# EAGLE design powerboost (EAGLE 7.6.0)
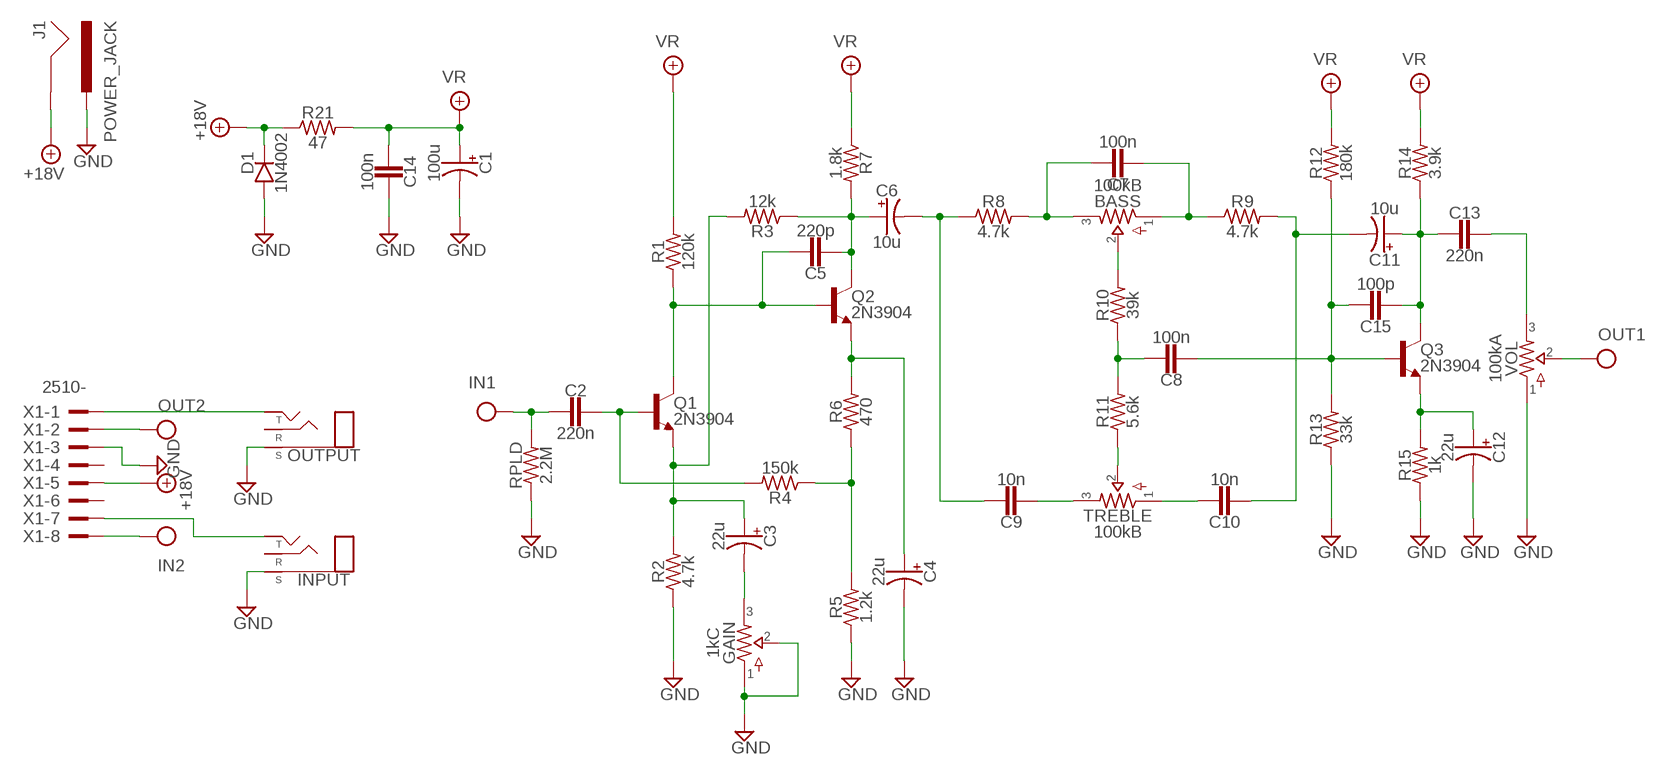
[diagram p0: schematic, sheet 1]

## Parts
BASS  100kB  POTS16MM  [16MM]
C1  100u  0631  [063_025]
C2  220n  CER/FILMBOX.1  [BOX_SMALL]
C3  22u  0500  [050_020]
C4  22u  0500  [050_020]
C5  220p  CER/FILM2  [050X030_025_2]
C6  10u  0501  [050_020_1]
C7  100n  CER/FILMBOX.1  [BOX_SMALL]
C8  100n  CER/FILMBOX.1  [BOX_SMALL]
C9  10n  CER/FILMBOX.1  [BOX_SMALL]
C10  10n  CER/FILMBOX.1  [BOX_SMALL]
C11  10u  0501  [050_020_1]
C12  22u  0500  [050_020]
C13  220n  CER/FILMBOX.1  [BOX_SMALL]
C14  100n  CER/FILM2  [050X030_025_2]
C15  100p  CER/FILM2  [050X030_025_2]
D1  1N4002  DO41.2  [DO41-2]
GAIN  1kC  POTS16MM  [16MM]
INPUT  STEREONMJ  [NMJ6HCD2]
J1  POWER_JACK  [POWER_JACK_PTH]
OUTPUT  STEREONMJ  [NMJ6HCD2]
Q1  2N3904  [TO92-]
Q2  2N3904  [TO92-]
Q3  2N3904  [TO92-]
R1  120k  R_.3B  [R0207/3]
R2  4.7k  R_.3B  [R0207/3]
R3  12k  R_.3B  [R0207/3]
R4  150k  R_.3B  [R0207/3]
R5  1.2k  R_.3B  [R0207/3]
R6  470  R_.3B  [R0207/3]
R7  1.8k  R_.3B  [R0207/3]
R8  4.7k  R_.3B  [R0207/3]
R9  4.7k  R_.3B  [R0207/3]
R10  39k  R_.3B  [R0207/3]
R11  5.6k  R_.3B  [R0207/3]
R12  180k  R_.3B  [R0207/3]
R13  33k  R_.3B  [R0207/3]
R14  3.9k  R_.3B  [R0207/3]
R15  1k  R_.3B  [R0207/3]
R21  47  R_.3B  [R0207/3]
RPLD  2.2M  R_.3B  [R0207/3]
TREBLE  100kB  POTS16MM  [16MM]
VOL  100kA  POTS16MM  [16MM]
X1  2510-  [PAK100/2500-10]

## Nets
+18V: D1.C J1.GND R21.1 X1.5
GND: C1.- C4.- C12.- C14.1 D1.A GAIN.1 GAIN.2 INPUT.S J1.PWR OUTPUT.S R2.1 R5.1 R13.1 R15.1 RPLD.1 VOL.1 X1.3
IN: C2.2 RPLD.2 X1.8
N$1: INPUT.T X1.7
N$4: OUTPUT.T X1.1
N$6: C5.1 Q1.1(C) Q2.2(B) R1.1
N$7: C2.1 Q1.2(B) R4.2
N$8: C3.+ Q1.3(E) R2.2 R3.2
N$9: C3.- GAIN.3
N$10: C5.2 C6.+ Q2.1(C) R3.1 R7.2
N$11: C6.- C9.1 R8.1
N$12: R4.1 R5.2 R6.1
N$14: BASS.3 C7.1 R8.2
N$15: BASS.1 C7.2 R9.1
N$16: BASS.2 R10.2
N$17: R11.1 TREBLE.2
N$18: C8.1 R10.1 R11.2
N$19: C9.2 TREBLE.3
N$20: C10.1 TREBLE.1
N$21: C10.2 C11.- R9.2
N$22: C8.2 C15.1 Q3.2(B) R12.1 R13.2
N$23: C11.+ C13.2 C15.2 Q3.1(C) R14.1
N$24: C12.+ Q3.3(E) R15.2
N$25: C13.1 VOL.3
N$26: C4.+ Q2.3(E) R6.2
OUT: VOL.2 X1.2
VR: C1.+ C14.2 R1.2 R7.1 R12.2 R14.2 R21.2
Unconnected: INPUT.R OUTPUT.R X1.4 X1.6

## Library data of the parts
BASS GAIN TREBLE VOL = pedals-potentiometers:POTS
C1 = pedals-capacitors-elec:063: 33 - 220uF Xicon values at Mouser.com 10V: 220uF; 16V: 100uF; 25V: 100uF; 50V: 33uF
C2 C5 C7-C10 C13-C15 = pedals-capacitors-film:CER/FILM: 47 - 120pF Xicon Ceramic Disc 2.5mm lead spacing
C3 C4 C6 C11 C12 = pedals-capacitors-elec:050
D1 = pedals-diodes:DO41: DO-41 Package Diodes: 1N4001 - 1N40019 Zener Diodes: 1N4728 - 1N4764
INPUT OUTPUT = pedals-jacks:STEREO
J1 = pedals-jacks:POWER_JACK: Power Jack Connector This is the standard 5.5mm barrel jack for power. The PTH is the most common, proven, reliable, footprint. The Slot footprint only works if the mill layer is transmitted to the PCB fab house so be warned. Here are the connectors we sell at SparkFun: DC Barrel Power Jack/Connector <https://www.sparkfun.com/products/119> (PRT-00119) DC Barrel Power Jack/Connector (SMD) <https://www.sparkfun.com/products/12748> (PRT-12748) DC Barrel Jack Adapter - Breadboard Compatible <https://www.sparkfun.com/products/10811> (PRT-10811) It is used on this SparkFun product (and many, many others): SparkFun RedBoard - Programmed with Arduino <https://www.sparkfun.com/products/12757> (DEV-12757) Also, if you need a mating power supply or connector, please check these out: Wall Adapter Power Supply - 9VDC 650mA <https://www.sparkfun.com/products/298> (TOL-00298) DC Barrel Jack Adapter - Male <https://www.sparkfun.com/products/10287> (PRT-10287); PROD_ID: CONN-08197
Q1-Q3 = pedals-transistors:2N3904: NPN Transistor
R1-R15 R21 RPLD = pedals-resistors:R_
X1 = pedals-headers:2510-: 3M (TM) Pak 100 4-Wall Header Source: 3M; MF: 3M; MPN: 2510-6002UB; OC_FARNELL: 9838244; OC_NEWARK: 46F4725

## Board
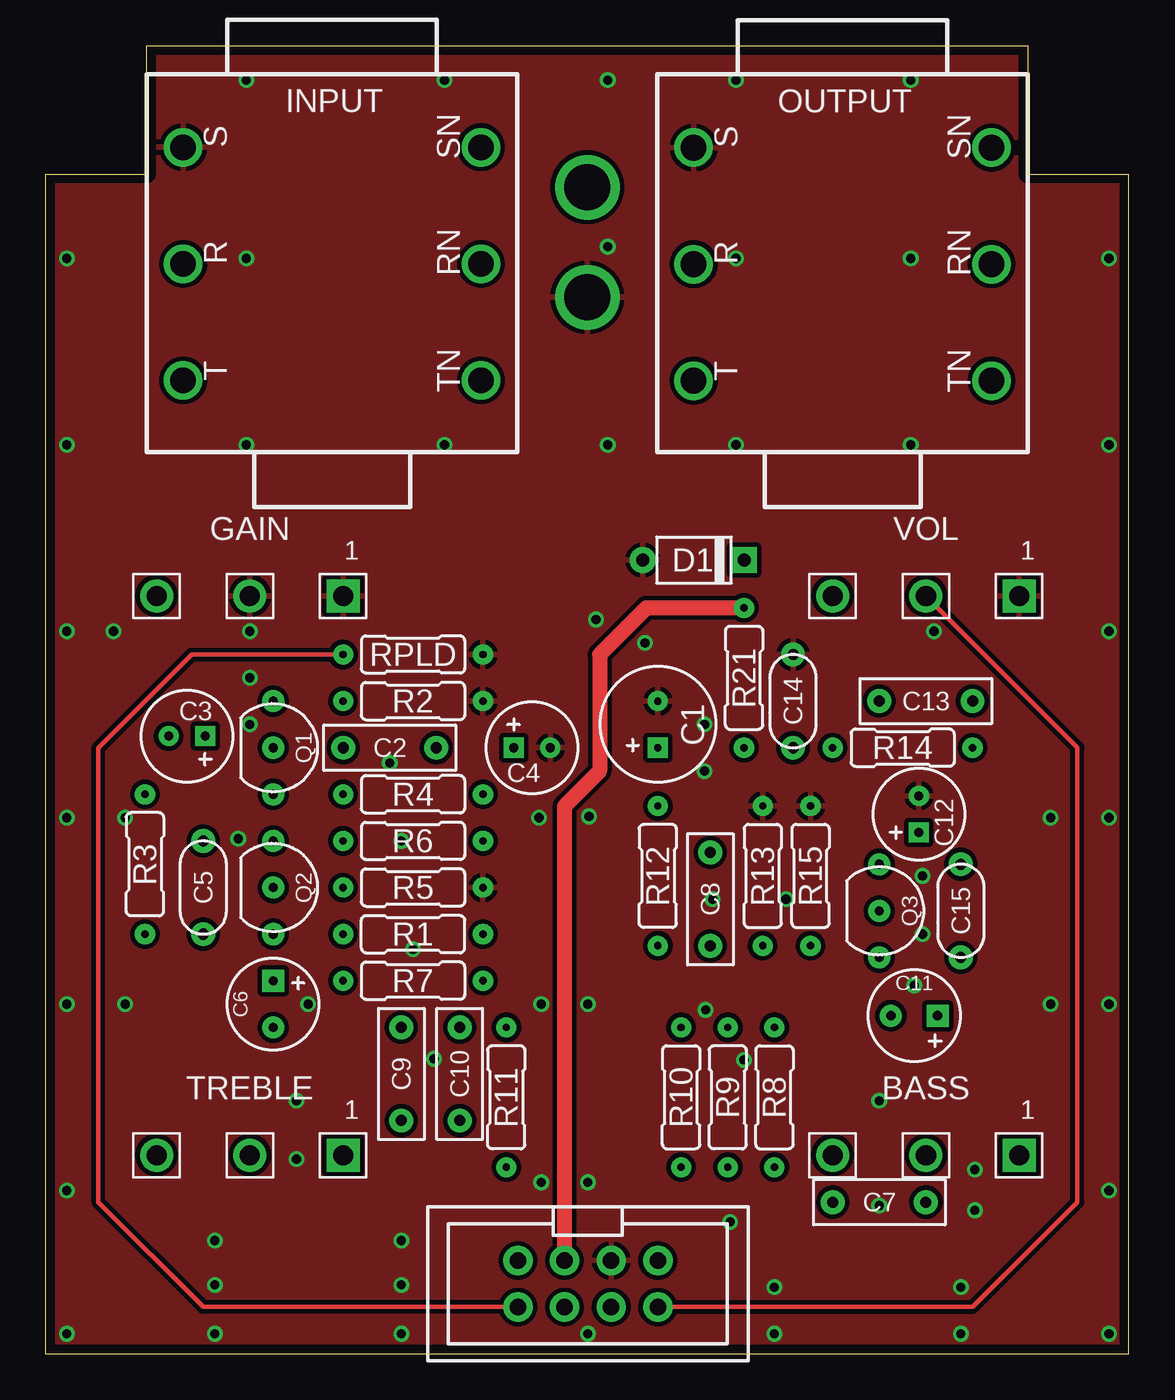
[diagram p1: board, top side]
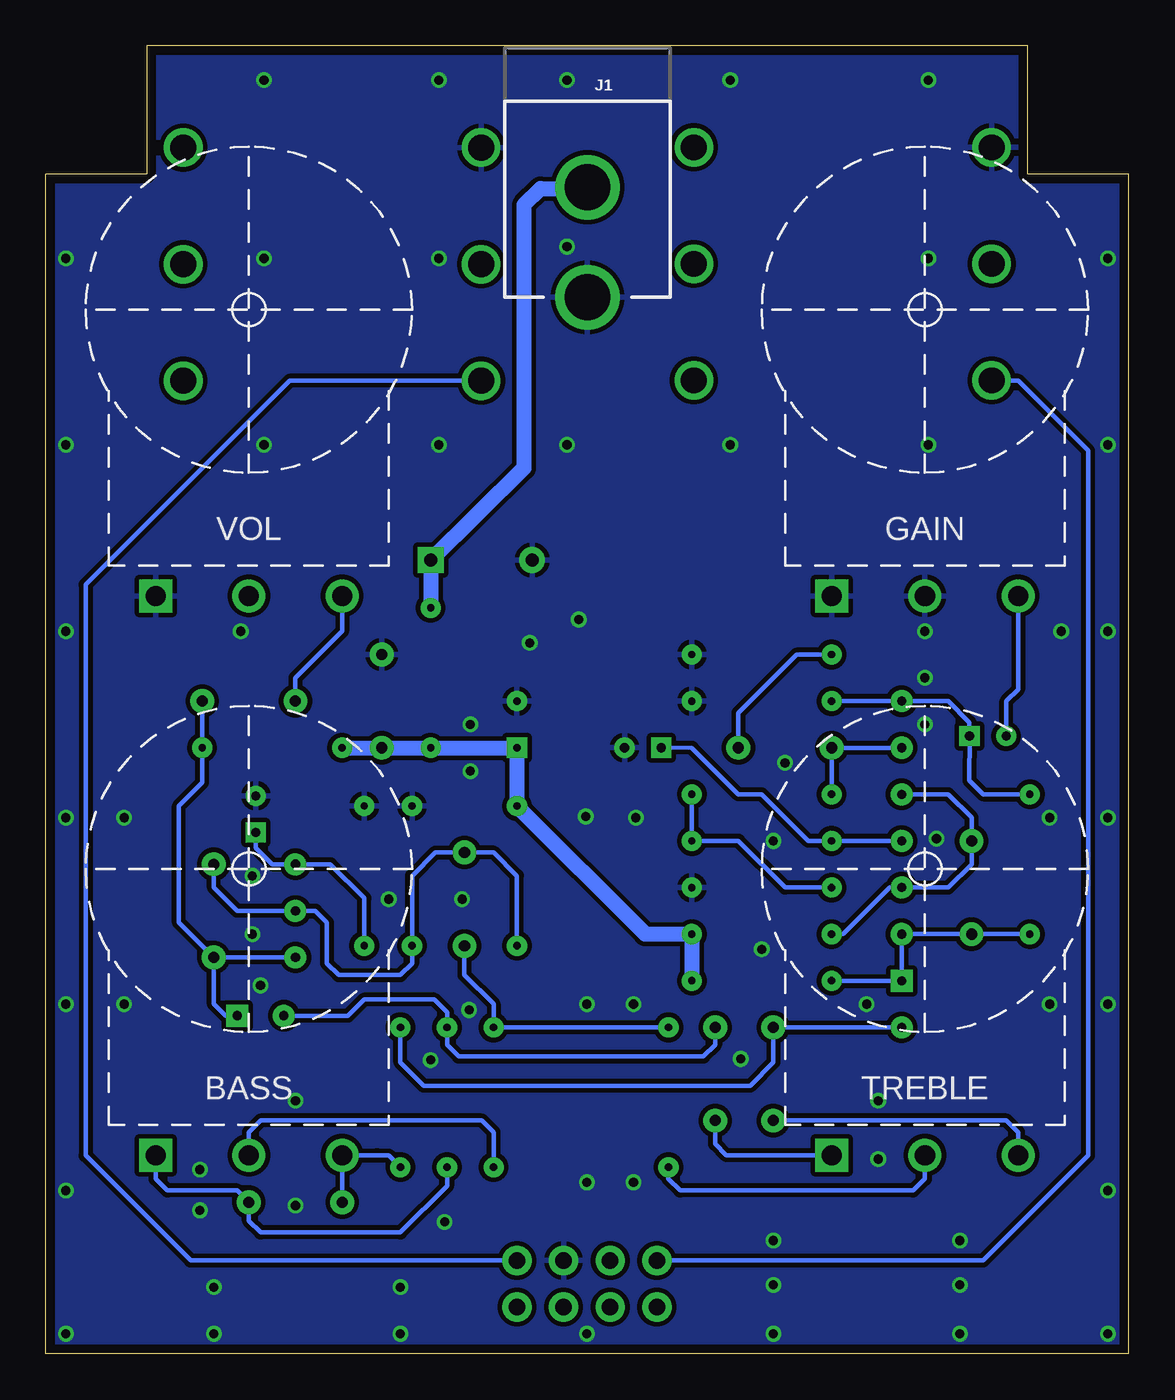
[diagram p2: board, bottom side, seen from below]

Size 59 x 71.27 mm. Coordinates in mm from the lower left corner, seen from the top.
Copper layers (1*16): Top 0.035mm / dielectric 1.6mm / Bottom 0.035mm
Design rules "Elecrow_2-layer_PCB_eagle_rule": minimum track width 6mil, minimum drill 12mil, track to track 6mil, track to pad 6mil, pad to pad 6mil, via to via 8mil, smd to smd 0mil, copper to edge 20mil, drill to drill 10mil, minimum pad ring 6mil, minimum via ring 6mil, stop-mask expansion 0mil, vias tented up to drill 100mil, thermal gap 10mil

### Footprints (pad centres in the part's own frame; a part is rotated, then mirrored left to right if it is on the bottom)
16MM = drill 1.1 pad 1.8 square: 1 5.08,-1 | drill 1.1 pad 1.8: 2 0,-1; 3 -5.08,-1
063_025 = drill 0.4 pad 1.1 square: + -1.27,0 | drill 0.4 pad 1.1: - 1.27,0
BOX_SMALL = drill 0.6 pad 1.3: 1 -2.54,0; 2 2.54,0
050_020 = drill 0.5 pad 1.1 square: + -0.998,0.001 | drill 0.5 pad 1.1: - 0.998,0.001
050X030_025_2 = drill 0.6 pad 1.3: 1 -2.54,0; 2 2.54,0
050_020_1 = drill 0.5 pad 1.2 square: + -1.27,0 | drill 0.5 pad 1.2: - 1.27,0
DO41-2 = drill 0.7 pad 1.4: A 2.794,0 | drill 0.7 pad 1.4 square: C -2.731,0
NMJ6HCD2 = drill 1.4: R 0,8.115; RN 0,-8.115; S 6.35,8.115; SN 6.35,-8.115; T -6.35,8.115; TN -6.35,-8.115
POWER_JACK_PTH = drill 2.5: GND 0,7.7; PWR 0,13.7
TO92- = drill 0.5 pad 1.2: 1 2.54,0; 2 0,0; 3 -2.54,0
R0207/3 = drill 0.4 pad 1.1: 1 -3.81,0; 2 3.81,0
PAK100/2500-10 = drill 0.9 pad 1.6: 1 -3.81,-1.27; 2 -3.81,1.27; 3 -1.27,-1.27; 4 -1.27,1.27; 5 1.27,-1.27; 6 1.27,1.27; 7 3.81,-1.27; 8 3.81,1.27

### Placement (x,y rotation side)
BASS  47.94,11.81 0 top
C1  33.34,34.29 90 top
C2  18.73,33.02 0 top
C3  7.68,33.66 180 top
C4  26.48,33.02 0 top
C5  8.57,25.4 270 top
C6  12.38,19.05 270 top
C7  45.4,8.26 0 top
C8  36.2,24.77 90 top
C9  19.37,15.24 270 top
C10  22.54,15.24 90 top
C11  47.31,18.41 180 top
C12  47.56,29.4 90 top
C13  47.94,35.56 0 top
C14  40.7,35.56 270 top
C15  49.85,24.13 270 top
D1  35.31,43.24 180 top
GAIN  11.11,42.29 0 top
INPUT  15.59,59.39 90 top
J1  29.5,71.27 180 bottom
OUTPUT  43.4,59.37 90 top
Q1  12.38,33.02 270 top
Q2  12.38,25.4 270 top
Q3  45.4,24.13 270 top
R1  20,22.86 0 top
R2  20,35.56 180 top
R3  5.4,26.67 90 top
R4  20,30.48 180 top
R5  20,25.4 180 top
R6  20,27.94 180 top
R7  20,20.32 180 top
R8  39.69,13.97 270 top
R9  37.15,13.97 90 top
R10  34.61,13.97 270 top
R11  25.08,13.97 90 top
R12  33.34,26.04 90 top
R13  39.05,26.04 270 top
R14  46.67,33.02 180 top
R15  41.66,26.04 270 top
R21  38.04,36.83 270 top
RPLD  20,38.1 180 top
TREBLE  11.11,11.81 0 top
U$1  [125B_PCB]  0,1.27 0 top
VOL  47.94,42.29 0 top
X1  29.53,3.81 180 top

### Tracks (layer width: path | path; a pad name or v marks a point on that pad's centre or on a via)
+18V
  Top 0.813: X1.5 28.26,29.84 30.16,31.75 30.16,38.1 32.7,40.64 R21.1
  Bottom 0.813: J1.GND 29.56,63.5 32.07,63.5 32.96,62.61 32.96,48.26 D1.C R21.1
GND  (via drill 0.5 pad 0.85)
  other vias: 57.91,59.69 57.91,49.53 10.92,69.41 21.72,69.41 30.61,69.41 1.14,49.53 10.92,59.69 10.92,49.53 21.72,49.53 30.61,60.33 30.61,49.53 37.59,69.41 47.12,69.41 37.59,59.69 37.59,49.53 47.12,59.69 47.12,49.53 57.91,39.37 57.91,29.21 57.91,19.05 57.91,8.89 57.91,1.08 49.85,1.08 39.69,1.08 29.53,1.08 19.37,1.08 9.21,1.08 1.14,1.08 1.14,59.69 1.14,39.37 1.14,29.21 1.14,19.05 1.14,8.89 54.74,29.21 54.74,19.05 50.61,7.81 49.85,3.62 39.69,3.62 19.37,3.75 9.21,3.75 4.32,19.05 4.32,29.21 3.68,39.37 9.21,6.16 19.37,6.16 13.65,10.6 13.65,13.78 45.4,8.06 45.4,13.78 48.39,39.37 29.53,9.33 26.99,9.33 29.53,19.05 26.99,19.05 29.59,29.27 26.86,29.21 20,22.03 18.73,32.19 29.97,40.01 36.32,24.77 47.75,26.04 32.64,38.74 47.75,22.86 47.31,20.07 10.48,28.07 50.61,10.03 37.27,7.18 35.88,34.29 35.88,31.75 40.32,24.77 11.11,34.29 11.11,36.83 11.11,39.37 19.37,27.94 14.29,19.05 35.94,18.73 38.04,16 21.15,16.07
  pour Top (isolate 0.254): 0.32,71.12 59.37,71.12 58.74,-1.27 0.32,-1.27
  pour Bottom (isolate 0.254): 0.32,0 59.37,0 59.37,71.75 -0.32,71.75 -0.32,0
IN
  Top 0.254: X1.8 8.57,2.54 2.86,8.26 2.86,33.02 7.94,38.1 RPLD.2
  Bottom 0.254: RPLD.2 18.1,38.1 21.27,34.93 C2.2
N$1
  Bottom 0.254: X1.7 7.94,5.08 2.22,10.79 2.22,49.21 6.03,53.02 7.46,53.02 INPUT.T
N$4
  Bottom 0.254: OUTPUT.T 45.72,53.02 56.83,41.91 56.83,10.79 51.12,5.08 X1.1
N$6
  Bottom 0.254: R1.1 15.56,22.86 13.02,25.4 Q2.2 9.84,25.4 8.57,26.67 C5.1 8.57,29.21 9.84,30.48 Q1.1
N$7
  Bottom 0.254: Q1.2 C2.1 R4.2
N$8
  Bottom 0.254: R2.2 Q1.3 9.84,35.56 8.68,34.4 C3.+ 8.68,31.23 7.94,30.48 R3.2
N$9
  Bottom 0.254: GAIN.3 6.03,36.2 6.67,35.56 6.67,33.66 C3.-
N$10
  Bottom 0.254: R3.1 C5.2 Q2.1 C6.+ R7.2
N$11
  Bottom 0.254: R8.1 39.69,15.88 38.42,14.61 20.64,14.61 19.37,15.88 C9.1 C6.-
N$12
  Bottom 0.254: R5.2 18.73,25.4 21.27,27.94 R6.1 R4.1
N$14
  Bottom 0.254: C7.1 BASS.3 40.97,10.81 40.96,10.79 40.32,10.79 R8.2
N$15
  Bottom 0.254: BASS.1 53.02,9.53 52.39,8.89 48.58,8.89 C7.2 47.94,7.24 47.31,6.6 39.69,6.6 37.15,9.14 R9.1
N$16
  Bottom 0.254: R10.2 34.61,12.06 35.24,12.7 47.31,12.7 47.94,12.06 BASS.2
N$17
  Bottom 0.254: TREBLE.2 11.11,9.53 11.75,8.89 24.45,8.89 25.08,9.53 R11.1
N$18
  Bottom 0.254: R11.2 R10.1 34.61,19.05 36.2,20.64 C8.1
N$19
  Bottom 0.254: TREBLE.3 6.03,12.06 6.67,12.7 C9.2
N$20
  Bottom 0.254: TREBLE.1 21.92,10.81 22.54,11.43 C10.1
N$21
  Bottom 0.254: C10.2 22.54,16.83 23.18,16.19 36.51,16.19 37.15,16.83 R9.2 37.15,18.61 37.85,19.3 41.66,19.3 42.54,18.41 C11.-
N$22
  Bottom 0.254: C15.1 49.85,25.4 48.58,24.13 Q3.2 44.32,24.13 43.69,23.5 43.69,21.27 43.05,20.64 39.69,20.64 39.05,21.27 R13.2 39.05,26.04 37.78,27.3 C8.2 34.61,27.3 33.34,26.04 R12.1
N$23
  Bottom 0.254: Q3.1 C15.2 | C11.+ 49.21,18.41 49.85,19.05 C15.2 | C15.2 51.75,23.5 51.75,29.84 50.48,31.11 R14.1 C13.2
N$24
  Bottom 0.254: R15.2 41.66,24.83 43.5,26.67 Q3.3 46.67,26.67 47.56,27.56 C12.+
N$25
  Bottom 0.254: VOL.3 42.86,39.37 45.4,36.83 C13.1
N$26
  Bottom 0.254: Q2.3 R6.2 17.46,27.94 20,30.48 21.27,30.48 23.81,33.02 C4.+
OUT
  Top 0.254: X1.2 50.48,2.54 56.2,8.26 56.2,33.04 VOL.2
VR
  Bottom 0.813: R7.1 R1.2 26.35,22.86 R12.2 C1.+ R21.2 C14.2 R14.2